# EAGLE design 04A-010 (EAGLE 9.6.2)
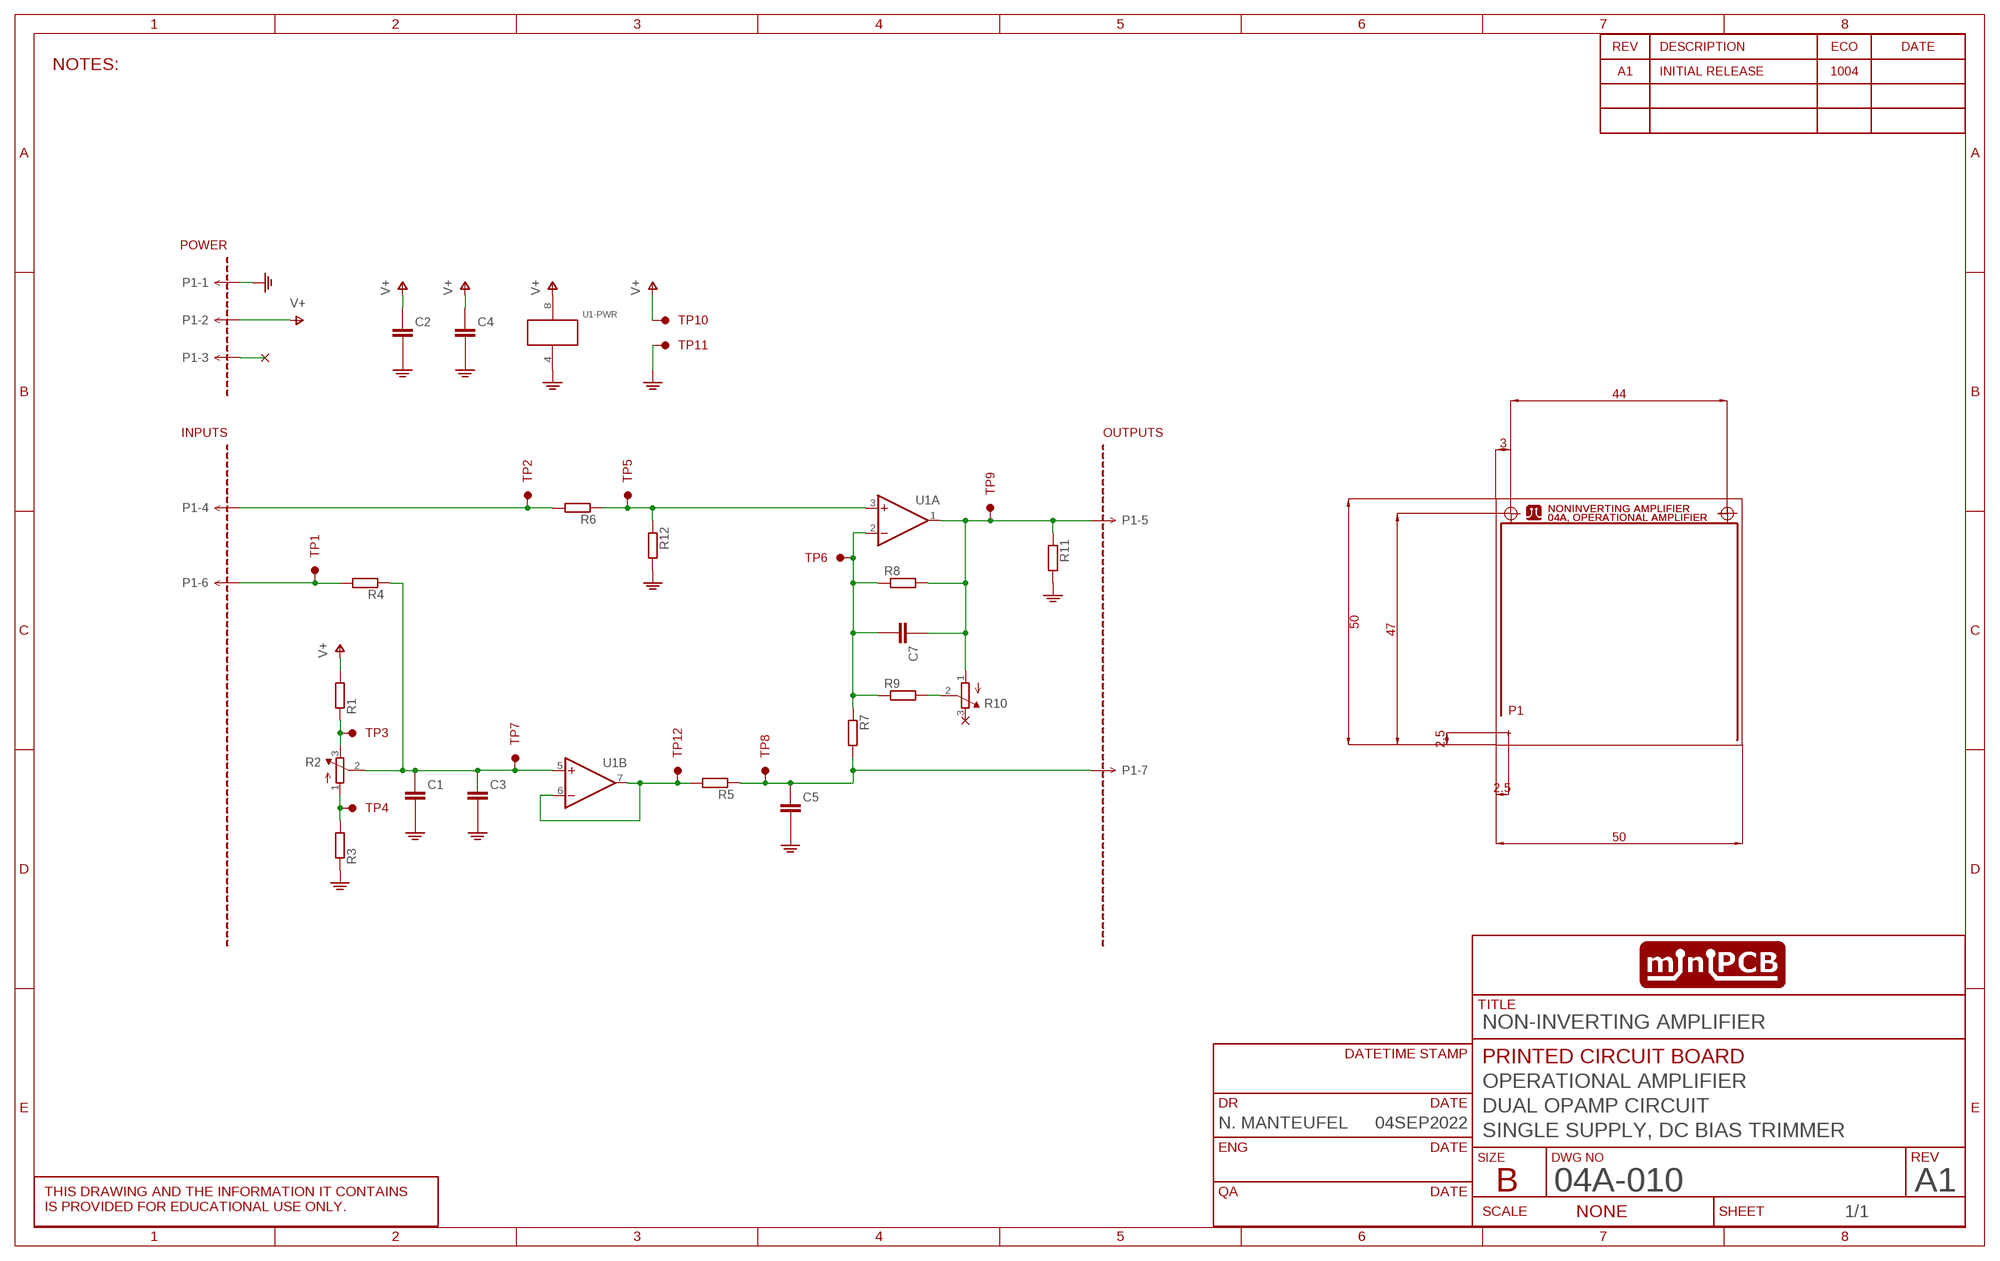
[diagram p0: schematic, sheet 1]
SHEET1 (SCHEMATIC): CIRCUIT_CATEGORY: OPERATIONAL AMPLIFIER; CIRCUIT_NAME: DUAL OPAMP CIRCUIT; CIRCUIT_VARIANT: SINGLE SUPPLY, DC BIAS TRIMMER; DR: N. MANTEUFEL; DR_DATE: 04SEP2022; PCB_PCBA: PRINTED CIRCUIT BOARD; REVA: A1; REVA_ECO: 1004; REVISION: A1; TITLE: NON-INVERTING AMPLIFIER

## Parts
C1  CAPACITORTHD  [C050-024X044]
C2  CAPACITORTHD  [C050-024X044]
C3  CAPACITOR_10  [C5MM]
C4  CAPACITOR_10  [C5MM]
C5  CAPACITORTHD  [C050-024X044]
C7  CAPACITORTHD  [C050-024X044]
P1  MINIPCB_7P  [PINS_1X7]
R1  RESISTOR10MM  [0207/10]
R2  TRIMPOT0.100THD  [TRIM_0100]
R3  RESISTOR10MM  [0207/10]
R4  RESISTOR10MM  [0207/10]
R5  RESISTOR10MM  [0207/10]
R6  RESISTOR10MM  [0207/10]
R7  RESISTOR10MM  [0207/10]
R8  RESISTOR10MM  [0207/10]
R9  RESISTOR10MM  [0207/10]
R10  TRIMPOT0.100THD  [TRIM_0100]
R11  RESISTOR10MM  [0207/10]
R12  RESISTOR10MM  [0207/10]
TP1  TESTPOINTKE5000-SMTEXT  [PINS_1_TESTPOINT_KE5000_NOTEXT]
TP2  TESTPOINTKE5000-SMTEXT  [PINS_1_TESTPOINT_KE5000_NOTEXT]
TP3  TESTPOINTKE5000-SMTEXT  [PINS_1_TESTPOINT_KE5000_NOTEXT]
TP4  TESTPOINTKE5000-SMTEXT  [PINS_1_TESTPOINT_KE5000_NOTEXT]
TP5  TESTPOINTKE5000-SMTEXT  [PINS_1_TESTPOINT_KE5000_NOTEXT]
TP6  TESTPOINTKE5000-SMTEXT  [PINS_1_TESTPOINT_KE5000_NOTEXT]
TP7  TESTPOINTKE5000-SMTEXT  [PINS_1_TESTPOINT_KE5000_NOTEXT]
TP8  TESTPOINTKE5000-SMTEXT  [PINS_1_TESTPOINT_KE5000_NOTEXT]
TP9  TESTPOINTKE5000-SMTEXT  [PINS_1_TESTPOINT_KE5000_NOTEXT]
TP10  TESTPOINTKE5000-SMTEXT  [PINS_1_TESTPOINT_KE5000_NOTEXT]
TP11  TESTPOINTKE5000-SMTEXT  [PINS_1_TESTPOINT_KE5000_NOTEXT]
TP12  TESTPOINTKE5000-SMTEXT  [PINS_1_TESTPOINT_KE5000_NOTEXT]
U1  OPAMP_DUALTHD  [DIL08]
U$1  MINIPCB_50X50  [MINIPCB_0P_50X50MM]

## Nets
BIAS: C1.1(+) C3.+ R2.2(S) R4.1 TP7.1 U1.5(B:+IN)
BIAS_CONTROL: P1.6 R4.2 TP1.1
GND: C1.2(-) C2.2(-) C3.- C4.- C5.2(-) P1.1 R3.1 R11.2 R12.2 TP11.1 U1.4(-PWR:V-)
IN: P1.4 R6.2 TP2.1
IN+: R6.1 R12.1 TP5.1 U1.3(A:+IN)
N$1: R9.2 R10.2(S)
NC: P1.3
OUT: C7.1(+) P1.5 R8.2 R10.1(A) R11.1 TP9.1 U1.1(A:OUT)
POT.1: R2.1(A) R3.2 TP4.1
POT.3: R1.1 R2.3(E) TP3.1
V+: C2.1(+) C4.+ P1.2 R1.2 TP10.1 U1.8(-PWR:V+)
VFB: C7.2(-) R7.1 R8.1 R9.1 TP6.1 U1.2(A:-IN)
VREF: R5.2 TP12.1 U1.6(B:-IN) U1.7(B:OUT)
VREF_FILTERED: C5.1(+) P1.7 R5.1 R7.2 TP8.1
Unconnected: R10.3(E)

## Notes on the sheet
- NOTES:

## Library data of the parts
C1-C5 C7 = minipcb:CAPACITOR
P1 = minipcb:MINIPCB_7P
R1 R3-R9 R11 R12 = minipcb:RESISTOR
R2 R10 = minipcb:TRIMPOT: SMT trimmer potentiometer part number TC33X http://www.ladyada.net/library/eagle
TP1-TP12 = minipcb:TESTPOINT
U1 = minipcb:OPAMP_DUAL: OP AMP
U$1 = minipcb:MINIPCB_50X50; CIRCUIT_CATEGORY: 04A, OPERATIONAL AMPLIFIER; PART_NUMBER: 04A-010; REVISION: A1-01; TITLE: NONINVERTING AMPLIFIER

## Board
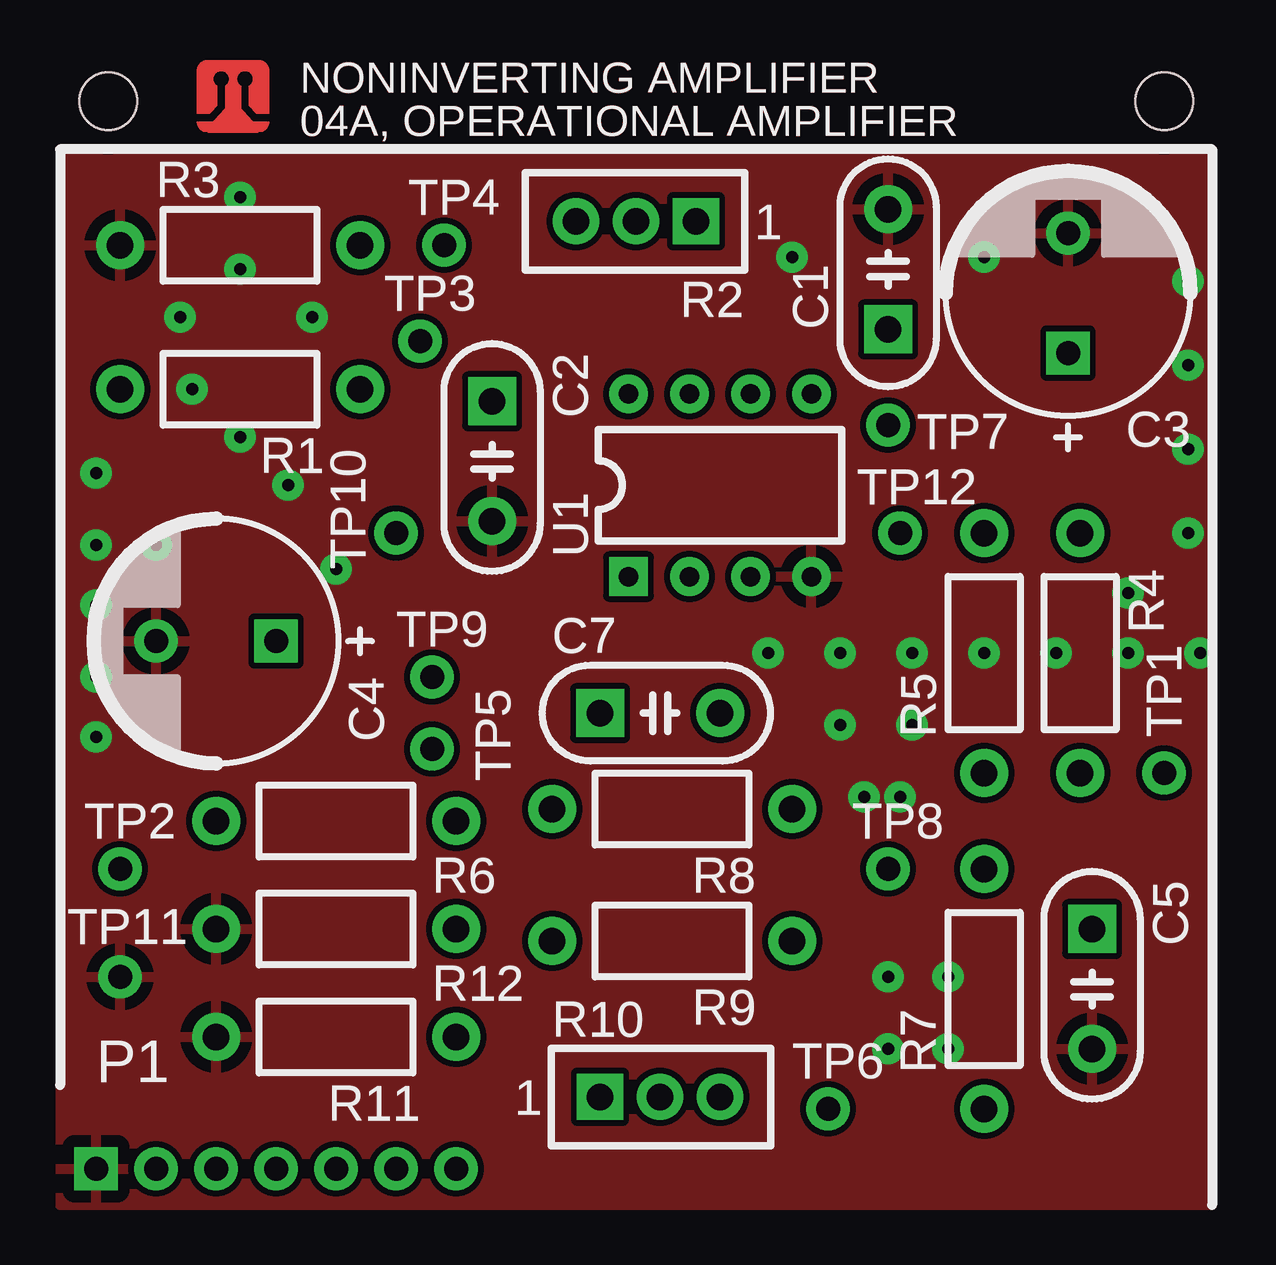
[diagram p1: board, top side]
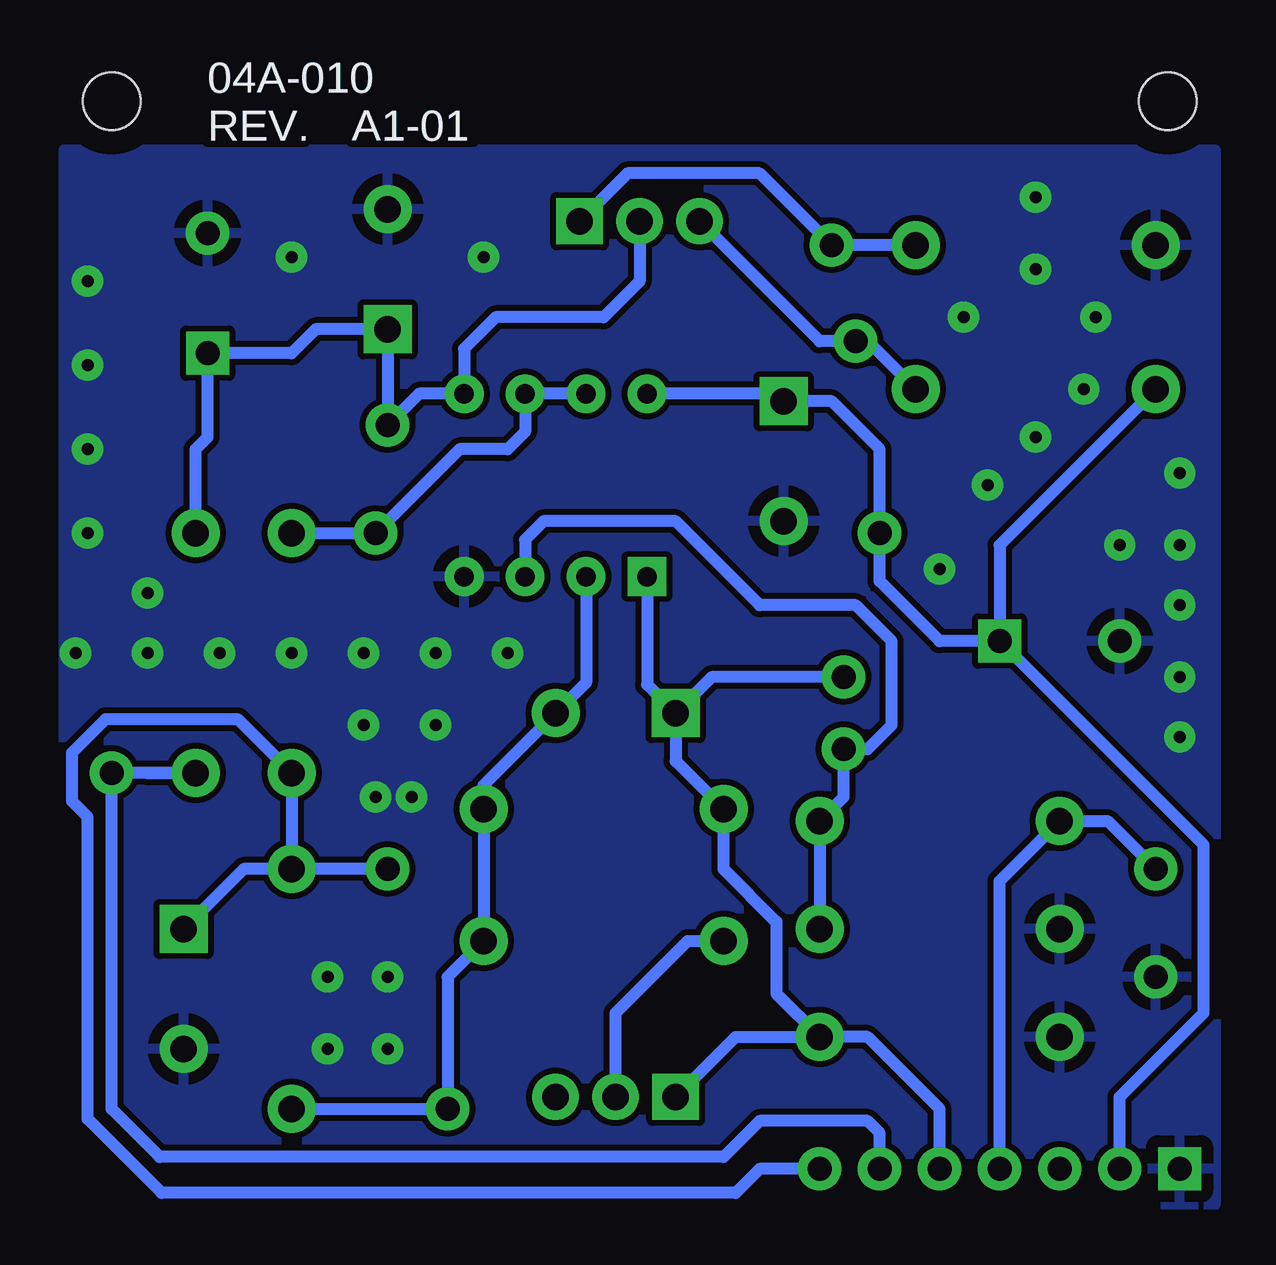
[diagram p2: board, bottom side, seen from below]

No outline drawn. Coordinates in mm, seen from the top.
Copper layers (1*16): Top 0.035mm / dielectric 1.5mm / Bottom 0.035mm
Design rules "minipcb": minimum track width 0.2mm, minimum drill 0.5mm, track to track 0.25mm, track to pad 0.5mm, pad to pad 0.5mm, via to via 0.5mm, smd to smd 0.15mm, copper to edge 1mm, drill to drill 1mm, minimum pad ring 0.4mm, minimum via ring 0.4mm, stop-mask expansion 0.1mm, vias tented up to drill 0.6mm, thermal gap 0.5mm

### Footprints (pad centres in the part's own frame; a part is rotated, then mirrored left to right if it is on the bottom)
C050-024X044 = drill 1.1 pad 2 square: 1 -2.5,0 | drill 1.1 pad 2: 2 2.5,0
C5MM = drill 1 square: + -2.5,0 | drill 1: - 2.5,0
PINS_1X7 = drill 1 square: 1 0,0 | drill 1: 2 2.5,0; 3 5,0; 4 7.5,0; 5 10,0; 6 12.5,0; 7 15,0
0207/10 = drill 1.1 pad 2: 1 -5,0; 2 5,0
TRIM_0100 = drill 1.1 pad 1.93 square: 1 0,0 | drill 1.1 pad 1.93: 2 2.5,0; 3 5,0
PINS_1_TESTPOINT_KE5000_NOTEXT = drill 1: 1 0,0
DIL08 = drill 0.813 square: 1 -3.81,-3.81 | drill 0.813: 2 -1.27,-3.81; 3 1.27,-3.81; 4 3.81,-3.81; 5 3.81,3.81; 6 1.27,3.81; 7 -1.27,3.81; 8 -3.81,3.81
MINIPCB_0P_50X50MM = hole 2.4: 47,47; 3,47

### Placement (x,y rotation side)
C1  35.5,40 90 top
C2  19,32 270 top
C3  43,39 90 top
C4  7.5,24.5 180 top
C5  44,10 270 top
C7  26,21.5 0 top
P1  2.5,2.5 0 top
R1  8.5,35 180 top
R2  27.5,42 180 top
R3  8.5,41 0 top
R4  43.5,24 270 top
R5  39.5,24 90 top
R6  12.5,17 180 top
R7  39.5,10 90 top
R8  26.5,17.5 180 top
R9  26.5,12 180 top
R10  23.5,5.5 0 top
R11  12.5,8 180 top
R12  12.5,12.5 180 top
TP1  47,19 0 top
TP2  3.5,15 0 top
TP3  16,37 0 top
TP4  17,41 0 top
TP5  16.5,20 270 top
TP6  33,5 0 top
TP7  35.5,33.5 180 top
TP8  35.5,15 0 top
TP9  16.5,23 0 top
TP10  15,29 90 top
TP11  3.5,10.5 0 top
TP12  36,29 270 top
U1  28.5,31 0 top
U$1  0,0 0 top

### Tracks (layer width: path | path; a pad name or v marks a point on that pad's centre or on a via)
BIAS
  Bottom 0.5: R2.2 25,39.5 26.5,38 31,38 32.31,36.69 U1.5 34.19,34.81 TP7.1 C1.1 38.5,37.5 39.5,36.5 C3.+ 43,33 43.5,32.5 R4.1
BIAS_CONTROL
  Bottom 0.5: P1.6 15,4 15.5,4.5 20,4.5 21.5,3 45,3 47,5 TP1.1 R4.2 45.5,19
GND  (via drill 0.5)
  other vias: 30.5,24 33.5,24 36.5,24 39.5,24 42.5,24 45.5,24 48.5,24 33.5,21 36.5,21 34.5,18 36,18 45.5,26.5 48,29 48,32.5 48,36 48,39.5 2.5,20.5 2.5,23 2.5,26 2.5,28.5 2.5,31.5 5,28.5 8.5,43 8.5,40 6,38 8.5,33 10.5,31 12.5,27.5 35.5,7.5 38,7.5 35.5,10.5 38,10.5 31.5,40.5 39.5,40.5 6.5,35 11.5,38
  pour Top: 1,1 49,1 49,45 1,45
  pour Bottom: 1,1 49,1 49,45 1,45
IN
  Bottom 0.5: P1.4 10,14.5 R6.2 5.5,17 TP2.1
IN+
  Bottom 0.5: U1.3 29.77,28.73 29,29.5 23.5,29.5 20,26 16,26 14.5,24.5 14.5,21 15.5,20 TP5.1 16.5,18 R6.1 R12.1
N$1
  Bottom 0.5: R10.2 26,9 23,12 R9.2
OUT
  Bottom 0.5: P1.5 12.5,5 15.5,8 R11.1 | R10.1 21,8 R11.1 | U1.1 24.69,22.69 C7.1 | C7.1 23.5,19.5 R8.2 21.5,15 19.3,12.8 19.3,9.8 R11.1 | TP9.1 22,23 C7.1
POT.1
  Bottom 0.5: R3.2 TP4.1 20,44 25.5,44 R2.1
POT.3
  Bottom 0.5: R1.1 15.5,37 TP3.1 17.5,37 R2.3
V+
  Bottom 0.5: P1.2 5,5.5 1.5,9 1.5,16 C4.+ | R1.2 10,28.5 C4.+ | C4.+ 12.5,24.5 15,27 TP10.1 15,32.5 17,34.5 C2.1 19.31,34.81 U1.8
VFB
  Bottom 0.5: U1.2 27.23,22.77 C7.2 31.5,18.5 R8.1 R9.1 33,10.5 TP6.1 R7.1
VREF
  Bottom 0.5: U1.7 U1.6 29.77,33.23 30.5,32.5 32.5,32.5 TP12.1 R5.2
VREF_FILTERED
  Bottom 0.5: P1.7 20,2.5 21,1.5 44.91,1.5 48,4.59 48,17.17 48.65,17.82 48.65,19.85 47.25,21.25 41.75,21.25 R5.1 R7.2 | TP8.1 R7.2 | R7.2 41.5,15 C5.1

### Text on the board
_tNames: R3 | TP4 | R2 | TP3 | C1 | C2 | C3 | R1 | TP7 | TP12 | U1 | TP10 | R4 | TP9 | C7 | C4 | TP5 | R5 | TP1 | TP2 | TP8 | R8 | R6 | C5 | TP11 | R12 | R9 | R10 | R7 | R11 | TP6